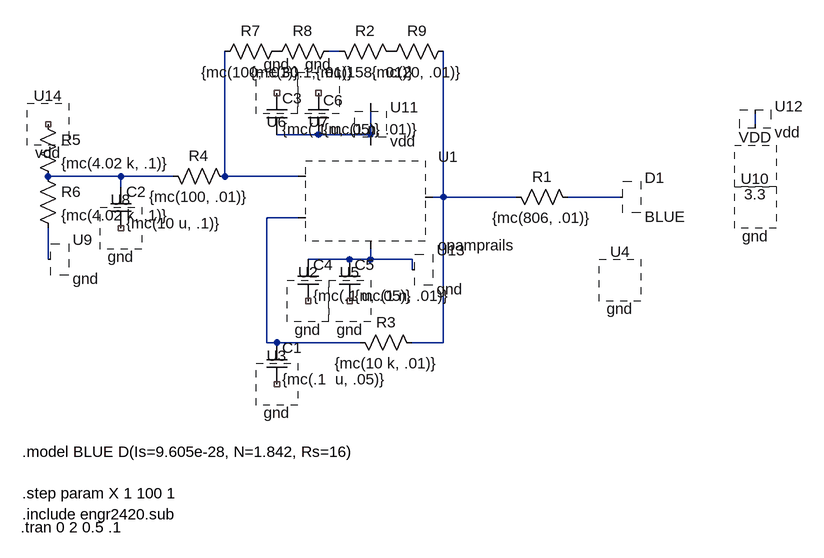
[diagram p0: schematic LTSpiceInverter.asc]
LTSpiceInverter.asc, the LTspice schematic file:
Version 4
SHEET 1 1152 684
WIRE 160 -64 144 -64
WIRE 800 48 800 32
WIRE 128 64 64 64
WIRE 208 64 208 16
WIRE 208 64 128 64
WIRE 208 80 208 64
WIRE -176 128 -288 128
WIRE -96 128 -176 128
WIRE -16 128 -16 -64
WIRE 96 128 -16 128
WIRE -176 144 -176 128
WIRE 320 160 320 -64
WIRE 320 160 304 160
WIRE 432 160 320 160
WIRE 592 160 512 160
WIRE 96 192 48 192
WIRE -288 256 -288 208
WIRE 176 256 112 256
WIRE 208 256 208 240
WIRE 208 256 176 256
WIRE 272 256 208 256
WIRE 272 272 272 256
WIRE 48 384 48 192
WIRE 64 384 48 384
WIRE 192 384 64 384
WIRE 320 384 320 160
WIRE 320 384 272 384
SYMBOL res 416 144 M90
WINDOW 0 0 56 VBottom 2
WINDOW 3 32 56 VTop 2
SYMATTR InstName R1
SYMATTR Value {mc(806, .01)}
SYMBOL res 144 -80 M90
WINDOW 0 0 56 VBottom 2
WINDOW 3 32 56 VTop 2
SYMATTR InstName R2
SYMATTR Value {mc(158, .01)}
SYMBOL res 176 368 M90
WINDOW 0 0 56 VBottom 2
WINDOW 3 32 56 VTop 2
SYMATTR InstName R3
SYMATTR Value {mc(10 k, .01)}
SYMBOL res -112 112 M90
WINDOW 0 0 56 VBottom 2
WINDOW 3 32 56 VTop 2
SYMATTR InstName R4
SYMATTR Value {mc(100, .01)}
SYMBOL cap 48 384 R0
SYMATTR InstName C1
SYMATTR Value {mc(.1  u, .05)}
SYMBOL cktsym\\gnd 64 448 R0
SYMATTR InstName U3
SYMBOL cktsym\\diode 592 224 R0
SYMATTR Value BLUE
SYMATTR InstName D1
SYMBOL cktsym\\gnd 592 288 R0
SYMATTR InstName U4
SYMBOL cap -192 144 R0
SYMATTR InstName C2
SYMATTR Value {mc(10 u, .1)}
SYMBOL cap 48 0 R0
SYMATTR InstName C3
SYMATTR Value {mc(.1 u, .05)}
SYMBOL cap 96 256 R0
SYMATTR InstName C4
SYMATTR Value {mc(.1 u, .05)}
SYMBOL cap 160 256 R0
SYMATTR InstName C5
SYMATTR Value {mc(1 n, .01)}
SYMBOL cap 112 0 R0
WINDOW 0 23 11 Left 2
SYMATTR InstName C6
SYMATTR Value {mc(1 n, .01)}
SYMBOL cktsym\\opamprails 192 160 R0
SYMATTR InstName U1
SYMBOL cktsym\\gnd 112 320 R0
SYMATTR InstName U2
SYMBOL cktsym\\gnd 176 320 R0
SYMATTR InstName U5
SYMBOL cktsym\\gnd 64 0 R180
SYMATTR InstName U6
SYMBOL cktsym\\gnd 128 0 R180
SYMATTR InstName U7
SYMBOL cktsym\\gnd -176 208 R0
SYMATTR InstName U8
SYMBOL cktsym\\gnd -288 256 R0
SYMATTR InstName U9
SYMBOL cktsym\\gnd 800 176 R0
SYMATTR InstName U10
SYMBOL cktsym\\vdd 208 16 R0
SYMATTR InstName U11
SYMBOL cktsym\\vdd 800 32 R0
SYMATTR InstName U12
SYMBOL cktsym\\vsource 800 112 R0
SYMATTR Value 3.3
SYMATTR InstName VDD
SYMBOL cktsym\\gnd 272 272 R0
SYMATTR InstName U13
SYMBOL res -304 32 R0
SYMATTR InstName R5
SYMATTR Value {mc(4.02 k, .1)}
SYMBOL res -304 112 R0
SYMATTR InstName R6
SYMATTR Value {mc(4.02 k, .1)}
SYMBOL cktsym\\vdd -288 48 R0
SYMATTR InstName U14
SYMBOL res 80 -80 R90
WINDOW 0 0 56 VBottom 2
WINDOW 3 32 56 VTop 2
SYMATTR InstName R7
SYMATTR Value {mc(100, .01)}
SYMBOL res 160 -80 R90
WINDOW 0 0 56 VBottom 2
WINDOW 3 32 56 VTop 2
SYMATTR InstName R8
SYMATTR Value {mc(30.1, .01)}
SYMBOL res 336 -80 R90
WINDOW 0 0 56 VBottom 2
WINDOW 3 32 56 VTop 2
SYMATTR InstName R9
SYMATTR Value {mc(20, .01)}
TEXT -328 552 Left 2 !.model BLUE D(Is=9.605e-28, N=1.842, Rs=16)
TEXT -328 616 Left 2 !.step param X 1 100 1
TEXT -328 648 Left 2 !.include engr2420.sub
TEXT -330 668 Left 2 !.tran 0 2 0.5 .1

The netlist it stands for:
* LTSpiceInverter.asc
R1 N006 N007 {mc(806, .01)}
R2 N001 P001 {mc(158, .01)}
R3 N008 N006 {mc(10 k, .01)}
R4 N004 N005 {mc(100, .01)}
C1 N008 NC_01 {mc(.1  u, .05)}
* U3: gnd (symbol cktsym\gnd not available, pin order unknown); nets seen at it: 
* D1: BLUE (symbol cktsym\diode not available, pin order unknown); nets seen at it: N007
* U4: gnd (symbol cktsym\gnd not available, pin order unknown); nets seen at it: 
C2 N004 NC_02 {mc(10 u, .1)}
C3 NC_03 N003 {mc(.1 u, .05)}
C4 N010 NC_04 {mc(.1 u, .05)}
C5 N010 NC_05 {mc(1 n, .01)}
C6 NC_06 N003 {mc(1 n, .01)}
* U1: opamprails (symbol cktsym\opamprails not available, pin order unknown); nets seen at it: N005, N006, N008, N010
* U2: gnd (symbol cktsym\gnd not available, pin order unknown); nets seen at it: 
* U5: gnd (symbol cktsym\gnd not available, pin order unknown); nets seen at it: 
* U6: gnd (symbol cktsym\gnd not available, pin order unknown); nets seen at it: 
* U7: gnd (symbol cktsym\gnd not available, pin order unknown); nets seen at it: 
* U8: gnd (symbol cktsym\gnd not available, pin order unknown); nets seen at it: 
* U9: gnd (symbol cktsym\gnd not available, pin order unknown); nets seen at it: N009
* U10: gnd (symbol cktsym\gnd not available, pin order unknown); nets seen at it: 
* U11: vdd (symbol cktsym\vdd not available, pin order unknown); nets seen at it: N003
* U12: vdd (symbol cktsym\vdd not available, pin order unknown); nets seen at it: N002
* VDD: 3.3 (symbol cktsym\vsource not available, pin order unknown); nets seen at it: 
* U13: gnd (symbol cktsym\gnd not available, pin order unknown); nets seen at it: N010
R5 NC_07 N004 {mc(4.02 k, .1)}
R6 N004 N009 {mc(4.02 k, .1)}
* U14: vdd (symbol cktsym\vdd not available, pin order unknown); nets seen at it: 
R7 P002 N005 {mc(100, .01)}
R8 N001 P002 {mc(30.1, .01)}
R9 N006 P001 {mc(20, .01)}
.model BLUE D(Is=9.605e-28, N=1.842, Rs=16)
.step param X 1 100 1
.include engr2420.sub
.tran 0 2 0.5 .1
.backanno
.end